# Altium schematic sheet reflex.SchDoc
size A4
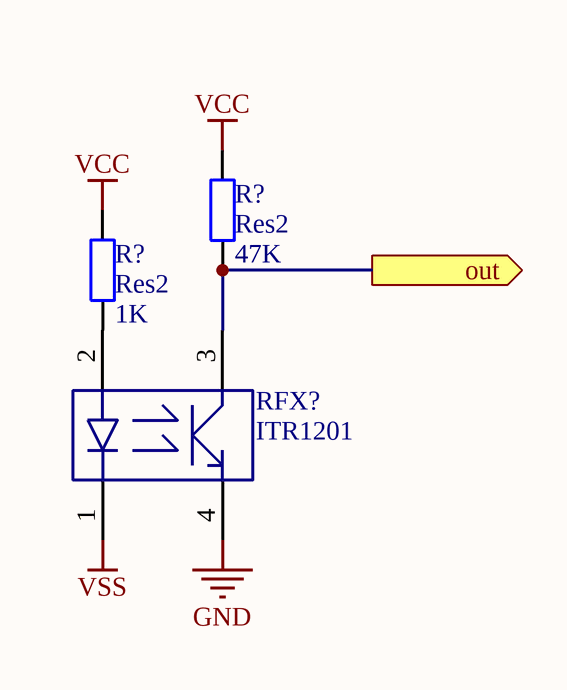
[diagram p0: reflex.SchDoc]

## Parts
(Parts that share a designator on the sheet are numbered #1, #2 ... from top to bottom, then left to right.)
R?#1  Res2  value 47K  [6-0805_N]
R?#2  Res2  value 1K  [6-0805_N]
RFX?  ITR1201  [LCC4 - duplicate4]

## Ports
out (out)

## Nets
GND: RFX?.4
VCC: R?#1.2 R?#2.2
VSS: RFX?.1
out: R?#1.1 RFX?.3 ; port out
NetR?#2_1: R?#2.1 RFX?.2

## Library data of the parts
R?#1 R?#2 = Res2: Resistor; Published: 8-Jun-2000; LatestRevisionDate: 17-Jul-2002; LatestRevisionNote: Re-released for DXP Platform.; PackageReference: AXIAL-0.4; Publisher: Altium Limited; PackageDescription: Axial Device, Thru-Hole; 2 Leads; 0.4 in Pin Spacing
RFX? = ITR1201: Name: ITR1201